# EAGLE design RJW VCA (EAGLE 7.5.0)
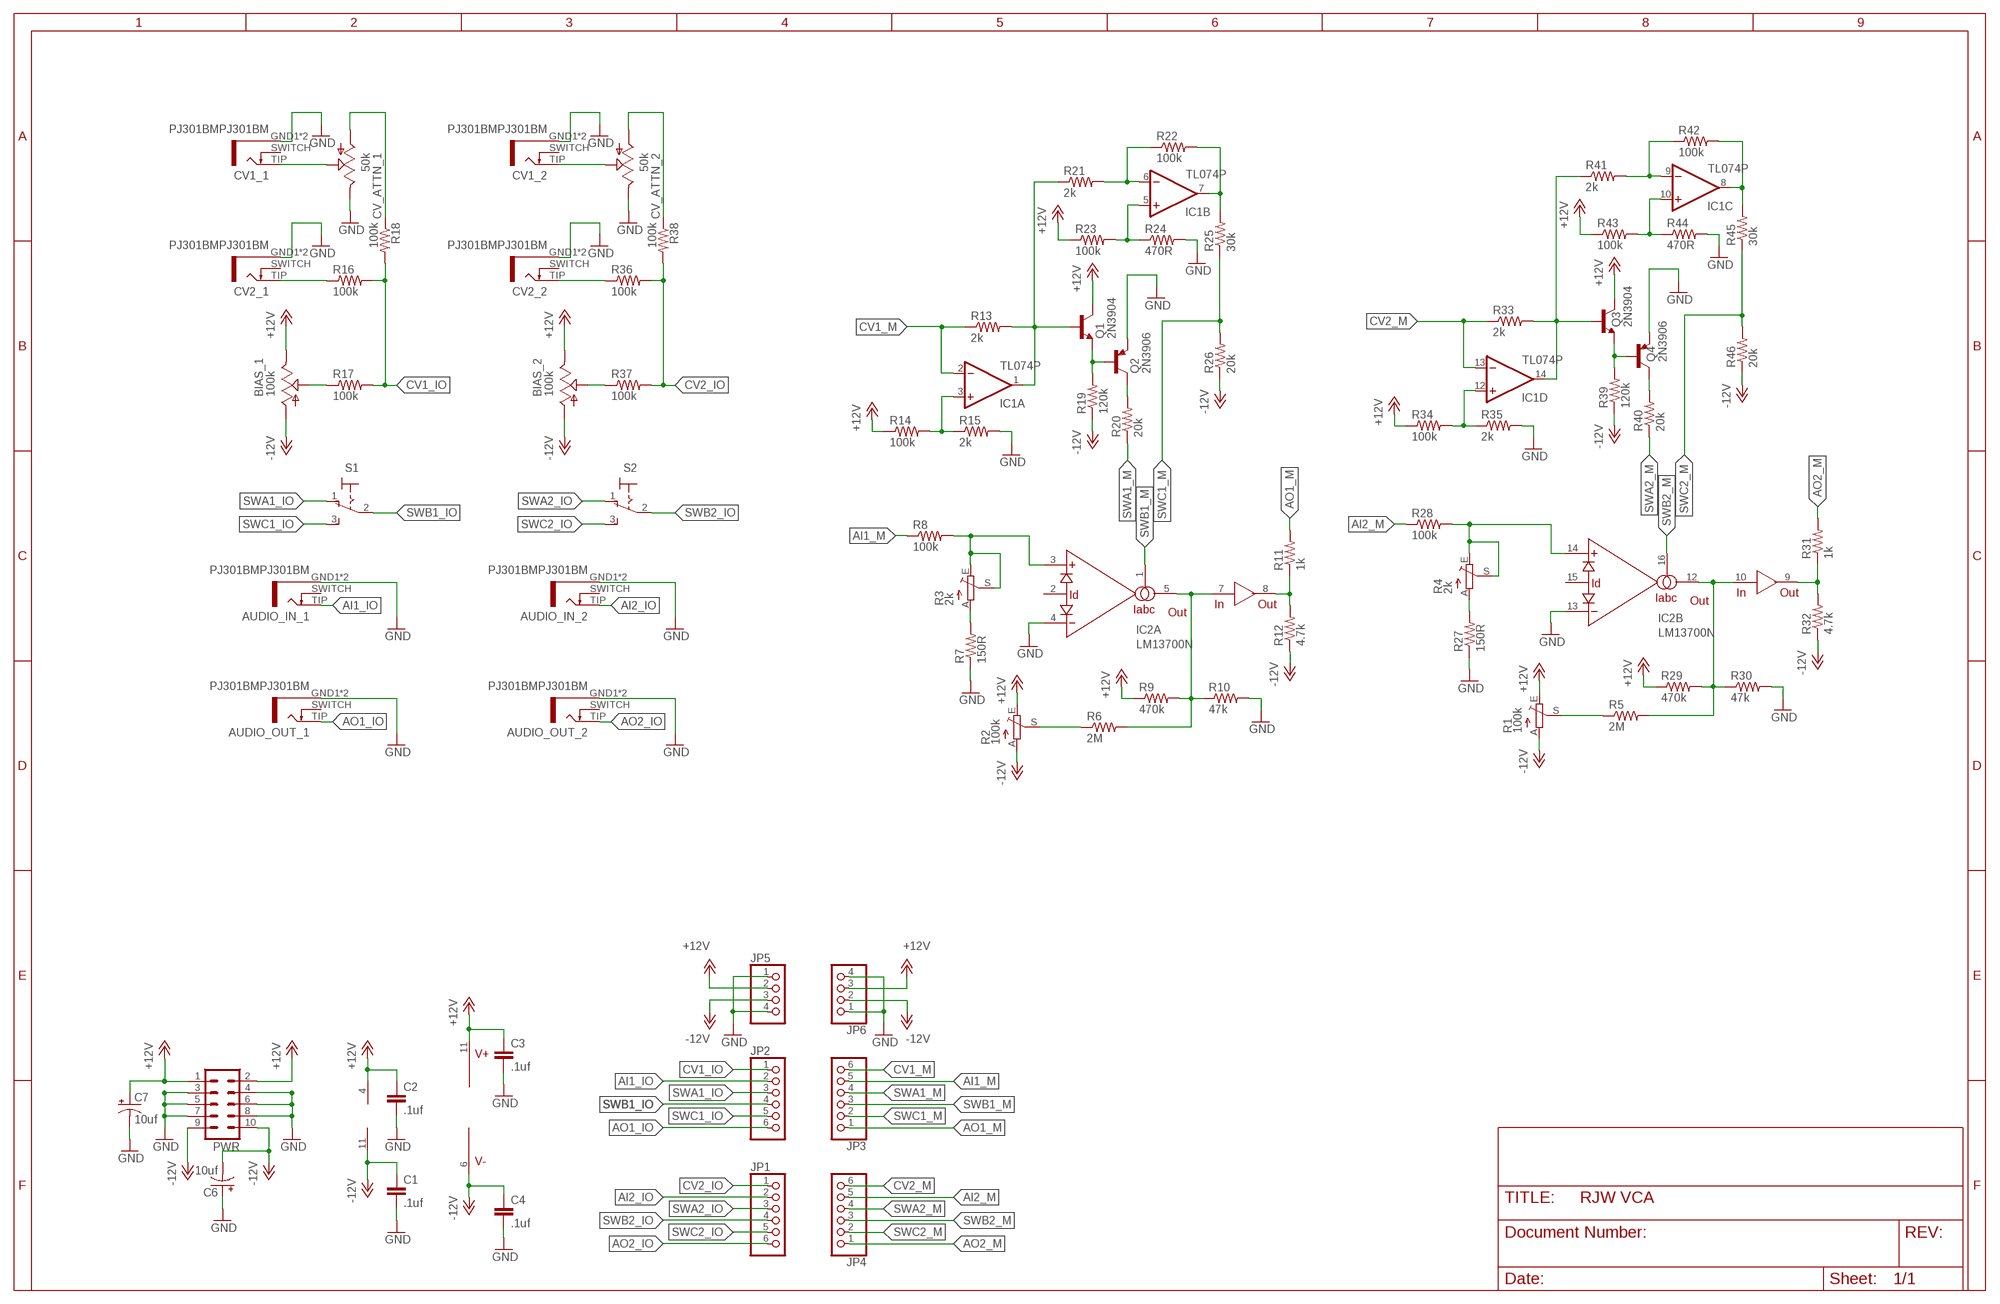
[diagram p0: schematic, sheet 1]

## Parts
AUDIO_IN_1  PJ301BMPJ301BM  [PJ301BM]
AUDIO_IN_2  PJ301BMPJ301BM  [PJ301BM]
AUDIO_OUT_1  PJ301BMPJ301BM  [PJ301BM]
AUDIO_OUT_2  PJ301BMPJ301BM  [PJ301BM]
BIAS_1  100k  ALPHA-9MMA  [EVUF]
BIAS_2  100k  ALPHA-9MMA  [EVUF]
C1  .1uf  C-EU050-024X044  [C050-024X044]
C2  .1uf  C-EU050-024X044  [C050-024X044]
C3  .1uf  C-EU050-024X044  [C050-024X044]
C4  .1uf  C-EU050-024X044  [C050-024X044]
C6  10uf  CPOL-USE2.5-5  [E2,5-5]
C7  10uf  CPOL-USE2.5-5  [E2,5-5]
CV1_1  PJ301BMPJ301BM  [PJ301BM]
CV1_2  PJ301BMPJ301BM  [PJ301BM]
CV2_1  PJ301BMPJ301BM  [PJ301BM]
CV2_2  PJ301BMPJ301BM  [PJ301BM]
CV_ATTN_1  50k  ALPHA-9MMA  [EVUF]
CV_ATTN_2  50k  ALPHA-9MMA  [EVUF]
IC1  TL074P  [DIL14]
IC2  LM13700N  [DIL16]
JP1  PINHD-1X6  [1X06]
JP2  PINHD-1X6  [1X06]
JP3  PINHD-1X6  [1X06]
JP4  PINHD-1X6  [1X06]
JP5  PINHD-1X4  [1X04]
JP6  PINHD-1X4  [1X04]
PWR  ML10  [ML10]
Q1  2N3904  [TO92]
Q2  2N3906  [TO92]
Q3  2N3904  [TO92]
Q4  2N3906  [TO92]
R1  100k  TRIM_1234-S64YW  [S64YW]
R2  100k  TRIM_1234-S64YW  [S64YW]
R3  2k  TRIM_1234-S64YW  [S64YW]
R4  2k  TRIM_1234-S64YW  [S64YW]
R5  2M  R-US_0204/7  [0204/7]
R6  2M  R-US_0204/7  [0204/7]
R7  150R  R-US_0204/7  [0204/7]
R8  100k  R-US_0204/7  [0204/7]
R9  470k  R-US_0204/7  [0204/7]
R10  47k  R-US_0204/7  [0204/7]
R11  1k  R-US_0204/7  [0204/7]
R12  4.7k  R-US_0204/7  [0204/7]
R13  2k  R-US_0204/7  [0204/7]
R14  100k  R-US_0204/7  [0204/7]
R15  2k  R-US_0204/7  [0204/7]
R16  100k  R-US_0204/7  [0204/7]
R17  100k  R-US_0204/7  [0204/7]
R18  100k  R-US_0204/7  [0204/7]
R19  120k  R-US_0204/7  [0204/7]
R20  20k  R-US_0204/7  [0204/7]
R21  2k  R-US_0204/7  [0204/7]
R22  100k  R-US_0204/7  [0204/7]
R23  100k  R-US_0204/7  [0204/7]
R24  470R  R-US_0204/7  [0204/7]
R25  30k  R-US_0204/7  [0204/7]
R26  20k  R-US_0204/7  [0204/7]
R27  150R  R-US_0204/7  [0204/7]
R28  100k  R-US_0204/7  [0204/7]
R29  470k  R-US_0204/7  [0204/7]
R30  47k  R-US_0204/7  [0204/7]
R31  1k  R-US_0204/7  [0204/7]
R32  4.7k  R-US_0204/7  [0204/7]
R33  2k  R-US_0204/7  [0204/7]
R34  100k  R-US_0204/7  [0204/7]
R35  2k  R-US_0204/7  [0204/7]
R36  100k  R-US_0204/7  [0204/7]
R37  100k  R-US_0204/7  [0204/7]
R38  100k  R-US_0204/7  [0204/7]
R39  120k  R-US_0204/7  [0204/7]
R40  20k  R-US_0204/7  [0204/7]
R41  2k  R-US_0204/7  [0204/7]
R42  100k  R-US_0204/7  [0204/7]
R43  100k  R-US_0204/7  [0204/7]
R44  470R  R-US_0204/7  [0204/7]
R45  30k  R-US_0204/7  [0204/7]
R46  20k  R-US_0204/7  [0204/7]
S1  M9040P  [M9040P]
S2  M9040P  [M9040P]

## Nets
+12V: BIAS_1.3(E) BIAS_2.3(E) C2.1 C3.1 C7.+ IC1.4(P:V+) IC2.11(V+) JP5.2 JP6.3 PWR.1 PWR.2 Q1.1(C) Q3.1(C) R1.E R2.E R9.1 R14.1 R23.1 R29.1 R34.1 R43.1
-12V: BIAS_1.1(A) BIAS_2.1(A) C1.1 C4.1 C6.- IC1.11(P:V-) IC2.6(V-) JP5.3 JP6.2 PWR.9 PWR.10 R1.A R2.A R12.1 R19.1 R26.1 R32.1 R39.1 R46.1
AI1_IO: AUDIO_IN_1.TIP JP2.2
AI1_M: JP3.5 R8.1
AI2_IO: AUDIO_IN_2.TIP JP1.2
AI2_M: JP4.5 R28.1
AO1_IO: AUDIO_OUT_1.TIP JP2.6
AO1_M: JP3.1 R11.2
AO2_IO: AUDIO_OUT_2.TIP JP1.6
AO2_M: JP4.1 R31.2
CV1_IO: JP2.1 R16.2 R17.2 R18.2
CV1_M: IC1.2(A:-IN) JP3.6 R13.1
CV2_IO: JP1.1 R36.2 R37.2 R38.2
CV2_M: IC1.13(D:-IN) JP4.6 R33.1
GND: AUDIO_IN_1.GND1 AUDIO_IN_1.GND2 AUDIO_IN_2.GND1 AUDIO_IN_2.GND2 AUDIO_OUT_1.GND1 AUDIO_OUT_1.GND2 AUDIO_OUT_2.GND1 AUDIO_OUT_2.GND2 C1.2 C2.2 C3.2 C4.2 C6.+ C7.- CV1_1.GND1 CV1_1.GND2 CV1_2.GND1 CV1_2.GND2 CV2_1.GND1 CV2_1.GND2 CV2_2.GND1 CV2_2.GND2 CV_ATTN_1.3(E) CV_ATTN_2.3(E) IC2.4(A:-IN) IC2.13(B:-IN) JP5.1 JP5.4 JP6.1 JP6.4 PWR.3 PWR.4 PWR.5 PWR.6 PWR.7 PWR.8 Q2.3(E) Q4.3(E) R7.1 R10.2 R15.2 R24.2 R27.1 R30.2 R35.2 R44.2
IO_CV1: CV_ATTN_1.1(A) R18.1
IO_CV2: CV_ATTN_2.1(A) R38.1
N$1: R2.S R6.1
N$2: R3.A R7.2
N$3: IC2.3(A:+IN) R3.E R3.S R8.2
N$4: IC2.5(A:OUT) IC2.7(IN) R6.2 R9.2 R10.1
N$5: R4.A R27.2
N$7: IC2.8(OUT) R11.1 R12.2
N$8: BIAS_1.2(S) R17.1
N$9: IC1.1(A:OUT) Q1.2(B) R13.2 R21.1
N$10: IC1.3(A:+IN) R14.2 R15.1
N$11: IC1.5(B:+IN) R23.2 R24.1
N$12: CV2_1.TIP R16.1
N$15: Q1.3(E) Q2.2(B) R19.2
N$16: R1.S R5.1
N$17: Q2.1(C) R20.2
N$19: IC1.6(B:-IN) R21.2 R22.1
N$20: IC1.7(B:OUT) R22.2 R25.2
N$23: IC2.14(B:+IN) R4.E R4.S R28.2
N$24: IC2.10(IN) IC2.12(B:OUT) R5.2 R29.2 R30.1
N$27: IC2.9(OUT) R31.1 R32.2
N$29: IC1.14(D:OUT) Q3.2(B) R33.2 R41.1
N$30: IC1.12(D:+IN) R34.2 R35.1
N$34: Q3.3(E) Q4.2(B) R39.2
N$35: Q4.1(C) R40.2
N$36: IC1.9(C:-IN) R41.2 R42.1
N$37: IC1.8(C:OUT) R42.2 R45.2
N$38: IC1.10(C:+IN) R43.2 R44.1
N$41: CV1_1.TIP CV_ATTN_1.2(S)
N$46: CV1_2.TIP CV_ATTN_2.2(S)
N$47: BIAS_2.2(S) R37.1
N$48: CV2_2.TIP R36.1
SWA1_IO: JP2.3 S1.1(O)
SWA1_M: JP3.4 R20.1
SWA2_IO: JP1.3 S2.1(O)
SWA2_M: JP4.4 R40.1
SWB1_IO: JP2.4 S1.2(P)
SWB1_M: IC2.1(A:IABC) JP3.3
SWB2_IO: JP1.4 S2.2(P)
SWB2_M: IC2.16(B:IABC) JP4.3
SWC1_IO: JP2.5 S1.3(S)
SWC1_M: JP3.2 R25.1 R26.2
SWC2_IO: JP1.5 S2.3(S)
SWC2_M: JP4.2 R45.1 R46.2
Unconnected: AUDIO_IN_1.SWITCH AUDIO_IN_2.SWITCH AUDIO_OUT_1.SWITCH AUDIO_OUT_2.SWITCH CV1_1.SWITCH CV1_2.SWITCH CV2_1.SWITCH CV2_2.SWITCH IC2.2(A:ID) IC2.15(B:ID) R1.S@1(S) R2.S@1(S) R3.S@1(S) R4.S@1(S)

## Library data of the parts
AUDIO_IN_1 AUDIO_IN_2 AUDIO_OUT_1 AUDIO_OUT_2 CV1_1 CV1_2 CV2_1 CV2_2 = gerbster:PJ301BM
BIAS_1 BIAS_2 CV_ATTN_1 CV_ATTN_2 = TomW:ALPHA-9MM: 9 mm Square Rotary Potentiometers Source: Panasonic
C1-C4 = resistor:C-EU: CAPACITOR, European symbol
C6 C7 = resistor:CPOL-US: POLARIZED CAPACITOR, American symbol
IC1 = linear:TL074: OP AMP
IC2 = synthdiy:LM13700: National Dual OTA with buffers.
JP1-JP4 = pinhead:PINHD-1X6: PIN HEADER
JP5 JP6 = pinhead:PINHD-1X4: PIN HEADER
PWR = con-ml:ML10: HARTING; OC_FARNELL: unknown; OC_NEWARK: unknown
Q1 Q3 = transistor-npn:2N3904: NPN Transistor
Q2 Q4 = transistor-pnp:2N3906: PNP Transistor
R1-R4 = pot:TRIM_1234-: POTENTIOMETER
R5-R46 = resistor:R-US_: RESISTOR, American symbol
S1 S2 = switch:M9040P: TOGGLE SWITCH Marquardt

## Board
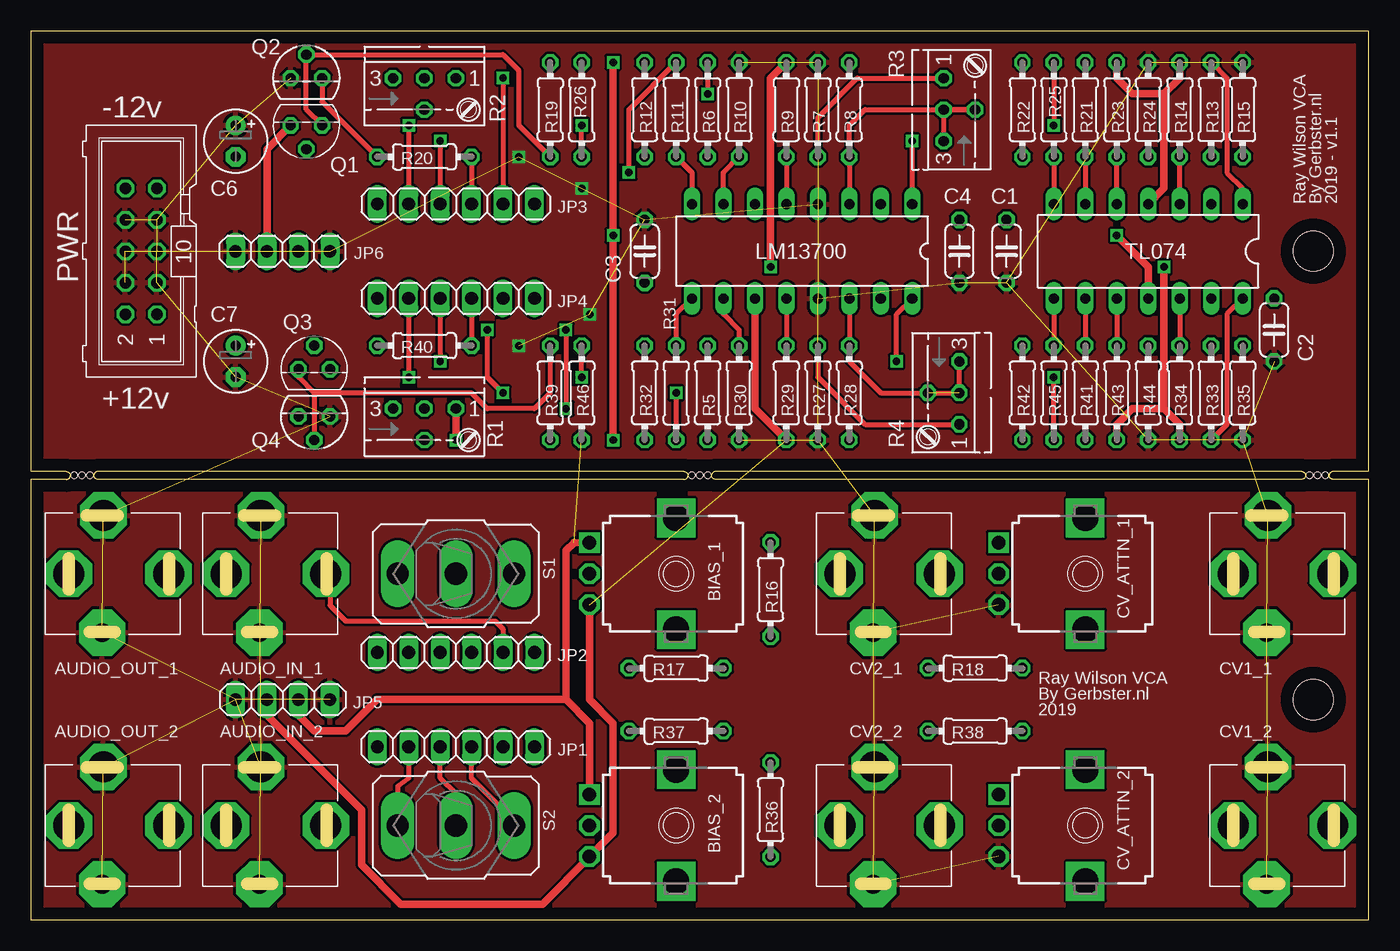
[diagram p1: board, top side]
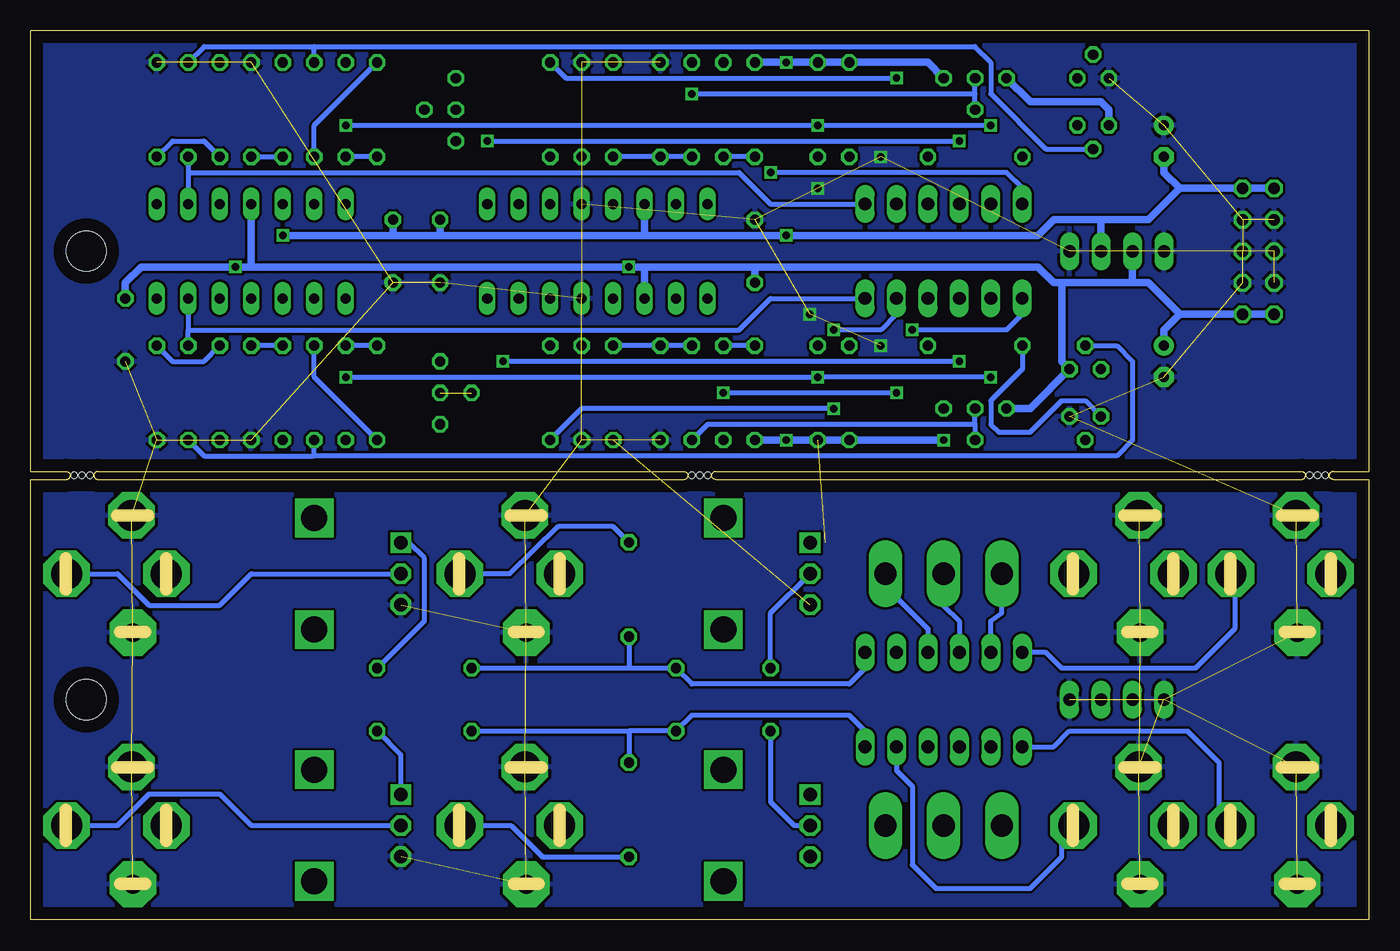
[diagram p2: board, bottom side, seen from below]

Size 107.95 x 71.75 mm. Coordinates in mm from the lower left corner, seen from the top.
Outline: 0,35.56 0,0 107.95,0 107.95,35.56 105.09,35.56 arc-90 104.78,35.88 arc-90 105.09,36.2 107.95,36.2 107.95,71.75 0,71.75 0,36.2 2.86,36.2 arc-90 3.17,35.88 arc-90 2.86,35.56 0,35.56
Outline: 102.55,35.56 55.24,35.56 arc-90 54.93,35.88 arc-90 55.24,36.2 102.55,36.2 arc-90 102.87,35.88 arc-90 102.55,35.56
Outline: 52.7,35.56 5.4,35.56 arc-90 5.08,35.88 arc-90 5.4,36.2 52.7,36.2 arc-90 53.02,35.88 arc-90 52.7,35.56
Copper layers (1*16): Top 0.035mm / dielectric 1.5mm / Bottom 0.035mm
Design rules "default": minimum track width 10mil, minimum drill 24mil, track to track 8mil, track to pad 8mil, pad to pad 8mil, via to via 8mil, smd to smd 8mil, copper to edge 40mil, drill to drill 8mil, minimum pad ring 10mil, minimum via ring 8mil, stop-mask expansion 4mil, vias tented up to drill 0mil, thermal gap 10mil
Holes 3.21 mm at 103.5,17.78 103.5,53.98
Holes 0.5 mm at 3.49,35.88 4.13,35.88 4.76,35.88 104.46,35.88 103.82,35.88 103.19,35.88 53.34,35.88 53.98,35.88 54.61,35.88

### Footprints (pad centres in the part's own frame; a part is rotated, then mirrored left to right if it is on the bottom)
PJ301BM = drill 2.5 pad 3.75 octagon: GND1 -4.719,-0.5; SWITCH 0,-3.3; TIP 0,4.746 | drill 1.5 pad 3.75 octagon: GND2 4.746,-0.6
EVUF = drill 1.1 pad 1.676 square: 1 -2.5,-7 | drill 1.1 pad 1.676 octagon: 2 0,-7; 3 2.5,-7 | drill 2.1 pad 2.8 square: M1 4.5,0; M2 -4.5,0
C050-024X044 = drill 0.813 octagon: 1 -2.54,0; 2 2.54,0
E2,5-5 = drill 0.813 pad 1.6: + -1.27,0 | drill 0.813 pad 1.6 octagon: - 1.27,0
DIL14 = drill 0.813 long: 1 -7.62,-3.81; 2 -5.08,-3.81; 3 -2.54,-3.81; 4 0,-3.81; 5 2.54,-3.81; 6 5.08,-3.81; 7 7.62,-3.81; 8 7.62,3.81; 9 5.08,3.81; 10 2.54,3.81; 11 0,3.81; 12 -2.54,3.81; 13 -5.08,3.81; 14 -7.62,3.81
DIL16 = drill 0.813 long: 1 -8.89,-3.81; 2 -6.35,-3.81; 3 -3.81,-3.81; 4 -1.27,-3.81; 5 1.27,-3.81; 6 3.81,-3.81; 7 6.35,-3.81; 8 8.89,-3.81; 9 8.89,3.81; 10 6.35,3.81; 11 3.81,3.81; 12 1.27,3.81; 13 -1.27,3.81; 14 -3.81,3.81; 15 -6.35,3.81; 16 -8.89,3.81
1X06 = drill 1.016 long: 1 -6.35,0; 2 -3.81,0; 3 -1.27,0; 4 1.27,0; 5 3.81,0; 6 6.35,0
1X04 = drill 1.016 long: 1 -3.81,0; 2 -1.27,0; 3 1.27,0; 4 3.81,0
ML10 = drill 0.914 octagon: 1 -5.08,-1.27; 2 -5.08,1.27; 3 -2.54,-1.27; 4 -2.54,1.27; 5 0,-1.27; 6 0,1.27; 7 2.54,-1.27; 8 2.54,1.27; 9 5.08,-1.27; 10 5.08,1.27
TO92 = drill 0.813 octagon: 1 1.27,0; 2 0,1.905; 3 -1.27,0
S64YW = drill 0.813 octagon: A 2.54,1.27; E -2.54,1.27; S 0,-1.27; S@1 0,1.27
0204/7 = drill 0.813 octagon: 1 -3.81,0; 2 3.81,0
M9040P = drill 1.803 long: 1 0,4.699; 2 0,0; 3 0,-4.699

### Placement (x,y rotation side)
AUDIO_IN_1  19.05,27.94 270 top
AUDIO_IN_2  19.05,7.62 270 top
AUDIO_OUT_1  6.35,27.94 270 top
AUDIO_OUT_2  6.35,7.62 270 top
BIAS_1  52.07,27.94 270 top
BIAS_2  52.07,7.62 270 top
C1  78.74,53.98 270 top
C2  100.33,47.62 270 top
C3  49.53,53.98 90 top
C4  74.93,53.98 270 top
C6  16.51,62.87 270 top
C7  16.51,45.09 270 top
CV1_1  100.33,27.94 270 top
CV1_2  100.33,7.62 270 top
CV2_1  68.58,27.94 270 top
CV2_2  68.58,7.62 270 top
CV_ATTN_1  85.09,27.94 270 top
CV_ATTN_2  85.09,7.62 270 top
IC1  90.17,53.98 180 top
IC2  62.23,53.98 180 top
JP1  34.29,13.97 180 top
JP2  34.29,21.59 180 top
JP3  34.29,57.78 0 top
JP4  34.29,50.16 0 top
JP5  20.32,17.78 0 top
JP6  20.32,53.98 180 top
PWR  8.89,53.98 90 top
Q1  22.23,64.14 180 top
Q2  22.23,67.94 0 top
Q3  22.86,44.45 0 top
Q4  22.86,40.64 180 top
R1  31.75,40.01 0 top
R2  31.75,66.67 0 top
R3  74.93,65.41 90 top
R4  73.66,42.55 270 top
R5  54.61,42.55 90 top
R6  54.61,65.41 270 top
R7  63.5,65.41 270 top
R8  66.04,65.41 270 top
R9  60.96,65.41 270 top
R10  57.15,65.41 90 top
R11  52.07,65.41 90 top
R12  49.53,65.41 270 top
R13  95.25,65.41 90 top
R14  92.71,65.41 270 top
R15  97.79,65.41 90 top
R16  59.69,26.67 270 top
R17  52.07,20.32 0 top
R18  76.2,20.32 180 top
R19  41.91,65.41 270 top
R20  31.75,61.59 180 top
R21  85.09,65.41 270 top
R22  80.01,65.41 270 top
R23  87.63,65.41 270 top
R24  90.17,65.41 90 top
R25  82.55,65.41 270 top
R26  44.45,65.41 270 top
R27  63.5,42.55 90 top
R28  66.04,42.55 90 top
R29  60.96,42.55 90 top
R30  57.15,42.55 270 top
R31  52.07,42.55 270 top
R32  49.53,42.55 90 top
R33  95.25,42.55 270 top
R34  92.71,42.55 90 top
R35  97.79,42.55 270 top
R36  59.69,8.89 90 top
R37  52.07,15.24 0 top
R38  76.2,15.24 180 top
R39  41.91,42.55 90 top
R40  31.75,46.35 180 top
R41  85.09,42.55 90 top
R42  80.01,42.55 90 top
R43  87.63,42.55 90 top
R44  90.17,42.55 270 top
R45  82.55,42.55 90 top
R46  44.45,42.55 90 top
S1  34.29,27.94 270 top
S2  34.29,7.62 270 top

### Tracks (layer width: path | path; a pad name or v marks a point on that pad's centre or on a via)
+12V  (via drill 0.6)  (1 unrouted)
  Top 0.61: JP6.3 19.05,62.23 Q1.1 | R43.1 87.63,40.01 88.9,41.27 91.44,41.27 | 91.44,41.27 92.71,40.01 R34.1 | 91.44,41.27 v91.44,52.7 | IC2.11 58.42,41.27 R29.1 | R14.1 92.71,67.94 91.44,66.67 | 91.44,66.67 91.44,59.05 IC1.4 | R23.1 87.63,67.94 88.9,66.67 91.44,66.67 | v59.69,52.7 59.69,67.94 R9.1 | BIAS_2.3 45.09,5.12 | BIAS_1.3 45.07,25.4 45.09,17.78 46.99,15.88 46.99,7.03 45.09,5.12 | JP5.2 19.05,16.51 26.67,8.89 26.67,4.45 29.84,1.27 41.27,1.27 45.09,5.08 45.09,5.12
  Bottom 0.61: C7.+ 16.51,47.62 15.24,48.9 | 8.89,48.9 PWR.1 | PWR.2 PWR.1 | PWR.1 15.24,48.9 | 19.05,51.44 17.78,51.44 15.24,48.9 | 19.05,51.44 24.77,51.44 | 24.77,51.44 24.77,45.09 Q3.1 27.3,41.27 R1.E | JP6.3 19.05,51.44 | 24.77,51.44 25.4,51.44 26.67,52.7 49.53,52.7 | C3.1 49.53,52.7 | 49.53,52.7 58.42,52.7 | 58.42,52.7 IC2.11 | C2.1 100.33,51.44 99.06,52.7 v91.44,52.7 90.17,52.7 | IC1.4 90.17,52.7 | 90.17,52.7 v59.69,52.7 58.42,52.7 | Q1.1 20.95,65.41 21.59,66.04 27.3,66.04 R2.E
-12V  (via drill 0.6)  (1 unrouted)
  Top 0.61: v87.63,55.24 90.17,52.7 IC1.11 | R1.A v34.29,38.73 | v46.99,38.73 v46.99,55.24 v46.99,69.22 | JP5.3 21.59,16.51 22.86,15.24 25.4,15.24 27.94,17.78 43.18,17.78 | 43.18,17.78 45.09,15.88 45.09,12.06 45.07,10.16 BIAS_2.1 | BIAS_1.1 43.81,30.48 43.81,30.44 43.18,29.8 43.18,17.78
  Bottom 0.406: R39.1 R46.1
  Bottom 0.61: PWR.10 PWR.9 15.24,59.05 | C6.- 16.51,60.33 15.24,59.05 | 15.24,59.05 17.78,56.52 21.59,56.52 | JP6.2 21.59,56.52 | 21.59,56.52 25.4,56.52 26.67,55.24 v46.99,55.24 58.42,55.24 | 58.42,55.24 IC2.6 | 58.42,55.24 74.93,55.24 | C4.1 74.93,55.24 | 74.93,55.24 78.74,55.24 | C1.1 78.74,55.24 | 78.74,55.24 v87.63,55.24 | R32.1 v46.99,38.73 R46.1 v34.29,38.73 | R12.1 v46.99,69.22 R26.1 R19.1 35.56,69.22 R2.A
AI1_IO
  Top 0.406: AUDIO_IN_1.TIP 24.13,27.94 24.13,25.4 25.4,24.13 37.47,24.13 38.1,23.5 JP2.2
AI1_M  (via drill 0.6)
  Top 0.406: v38.1,67.94 JP3.5
  Bottom 0.406: R8.1 64.77,67.94 v38.1,67.94
AI2_IO
  Bottom 0.406: JP1.2 38.1,12.06 36.83,10.79 36.83,4.45 34.92,2.54 27.3,2.54 24.77,5.08 24.77,7.62 AUDIO_IN_2.TIP
AI2_M  (via drill 0.6)
  Top 0.406: v43.18,47.62 v43.18,41.27
  Bottom 0.406: JP4.5 38.1,48.9 39.37,47.62 v43.18,47.62 | v43.18,41.27 63.5,41.27 R28.1
AO1_IO
  Bottom 0.406: AUDIO_OUT_1.TIP 10.79,27.94 10.79,23.5 13.97,20.32 24.77,20.32 26.04,21.59 JP2.6
AO1_M  (via drill 0.6)
  Top 0.406: v48.26,60.33 48.26,65.41 R11.2
  Bottom 0.406: JP3.1 27.94,59.05 29.21,60.33 v48.26,60.33
AO2_IO
  Bottom 0.406: JP1.6 25.4,13.97 24.13,15.24 14.61,15.24 12.06,12.7 12.06,8.89 AUDIO_OUT_2.TIP
AO2_M  (via drill 0.6)
  Top 0.406: v36.83,47.62 36.83,43.81 v38.1,42.55 | v52.07,42.55 R31.2
  Bottom 0.406: JP4.1 27.94,48.9 29.21,47.62 v36.83,47.62 | v38.1,42.55 v52.07,42.55
CV1_IO
  Bottom 0.406: JP2.1 40.64,20.32 41.91,19.05 54.61,19.05 R17.2 59.69,20.32 | R16.2 59.69,20.32 | 59.69,20.32 R18.2
CV1_M
  Bottom 0.406: R13.1 95.25,60.33 | 95.25,60.33 IC1.2 | 95.25,60.33 50.8,60.33 48.26,57.78 JP3.6
CV2_IO
  Bottom 0.406: JP1.1 40.64,15.24 41.91,16.51 54.61,16.51 R37.2 59.69,15.24 | 59.69,15.24 R36.2 | R38.2 59.69,15.24
CV2_M
  Bottom 0.406: IC1.13 95.25,47.62 | 95.25,47.62 50.8,47.62 48.26,50.16 JP4.6 | R33.1 95.25,47.62
GND  (via drill 0.6)  (49 unrouted)
  other vias: 45.09,48.9 44.45,59.05 39.37,61.59 39.37,46.35
  pour Top: 0,35.56 0,0 107.31,0 107.31,35.56
  pour Bottom: 0,35.56 0,0 107.31,0 107.31,35.56
  pour Bottom: 0,71.75 0,36.2 107.31,36.2 107.31,71.75
  pour Top: 0,71.75 0,36.2 107.31,36.2 107.31,71.75
IO_CV1
  Bottom 0.406: R18.1 76.2,24.13 76.2,29.21 77.47,30.48 78.09,30.48 CV_ATTN_1.1
IO_CV2
  Bottom 0.406: R38.1 78.11,13.34 78.11,10.16 78.09,10.16 CV_ATTN_2.1
N$1  (via drill 0.6)
  Top 0.406: R6.1 v54.61,66.67
  Bottom 0.406: v54.61,66.67 31.75,66.67 | 31.75,66.67 31.75,67.94 | R2.S 31.75,66.67
N$2
  Top 0.406: R7.2 63.5,64.77 66.67,67.94 R3.A
N$3
  Top 0.406: IC2.3 R8.2 66.04,64.14 67.31,65.41 R3.S 73.66,65.41 R3.E
N$4
  Top 0.406: IC2.7 55.88,60.33 R10.1 | R9.2 IC2.5
  Bottom 0.406: R6.2 R10.1 R9.2
N$5
  Top 0.406: R27.2 63.5,43.81 67.31,40.01 R4.A
N$7
  Top 0.406: R11.1 53.34,60.33 IC2.8
  Bottom 0.406: R12.2 R11.1
N$8
  Bottom 0.406: R17.1 48.26,24.77 BIAS_1.2
N$9
  Top 0.406: R13.2 96.52,67.94 96.52,60.33 97.79,59.05 IC1.1
  Bottom 0.406: R13.2 93.98,70.48 85.09,70.48 | R21.1 85.09,70.48 | 85.09,70.48 31.75,70.48 30.48,69.22 30.48,66.67 26.04,62.23 Q1.2
N$10
  Top 0.406: IC1.3 R14.2
  Bottom 0.406: R15.1 96.52,62.87 93.98,62.87 R14.2
N$11
  Top 0.406: IC1.5 R23.2
  Bottom 0.406: R24.1 R23.2
N$12
  Bottom 0.406: R16.1 60.96,31.75 65.41,31.75 69.32,27.94 CV2_1.TIP
N$15
  Top 0.406: Q1.3 22.23,65.41 Q2.2 38.1,69.85 39.37,68.58 39.37,64.14 R19.2
N$16
  Bottom 0.406: 31.75,40.01 53.34,40.01 R5.1 | 31.75,40.01 31.75,41.27 | 31.75,40.01 R1.S
N$17
  Top 0.406: Q2.1 23.5,66.04 R20.2
N$19
  Top 0.406: R21.2 IC1.6
  Bottom 0.406: R21.2 85.09,64.14 R22.1
N$20
  Top 0.406: R25.2 IC1.7
  Bottom 0.406: R22.2 R25.2
N$23  (1 unrouted)
  Top 0.406: IC2.14 R28.2 66.04,45.09 68.58,42.55 74.93,42.55 R4.E
N$24
  Top 0.406: IC2.10 55.88,48.9 57.15,47.62 R30.1 | IC2.12 R29.2
  Bottom 0.406: R5.2 R30.1 R29.2
N$27
  Top 0.406: IC2.9 52.07,48.9 R31.1
  Bottom 0.406: R32.2 R31.1
N$29
  Top 0.406: IC1.14 96.52,48.9 96.52,40.01 R33.2
  Bottom 0.406: R33.2 93.98,37.47 85.09,37.47 | Q3.2 20.32,46.35 19.05,45.09 19.05,38.73 20.32,37.47 85.09,37.47 | 85.09,37.47 R41.1
N$30
  Top 0.406: IC1.12 R34.2
  Bottom 0.406: R35.1 96.52,45.09 93.98,45.09 R34.2
N$34
  Top 0.406: Q3.3 21.59,43.81 22.86,42.55 | 22.86,42.55 Q4.2 | R39.2 41.91,42.55 40.64,41.27 36.83,41.27 35.56,42.55 22.86,42.55
N$35
  Bottom 0.406: R40.2 27.94,44.45 30.48,41.91 30.48,40.01 29.84,39.37 27.3,39.37 24.77,41.91 22.86,41.91 Q4.1
N$36
  Top 0.406: IC1.9 R41.2
  Bottom 0.406: R42.1 85.09,43.81 R41.2
N$37
  Top 0.406: IC1.8 R45.2
  Bottom 0.406: R42.2 R45.2
N$38
  Top 0.406: IC1.10 R43.2
  Bottom 0.406: R43.2 R44.1
N$41
  Bottom 0.406: CV1_1.TIP 100.97,27.94 98.42,25.4 92.71,25.4 90.17,27.94 CV_ATTN_1.2
N$46
  Bottom 0.406: CV1_2.TIP 100.97,7.62 98.42,10.16 92.71,10.16 90.17,7.62 CV_ATTN_2.2
N$47
  Bottom 0.406: R37.1 48.26,9.53 46.35,7.62 BIAS_2.2
N$48
  Bottom 0.406: CV2_2.TIP 69.22,7.62 66.67,5.08 R36.1
SWA1_IO
  Bottom 0.406: S1.1 38.73,27.94 38.73,26.67 35.56,23.5 JP2.3
SWA1_M
  Top 0.406: R20.1 JP3.4
SWA2_IO
  Top 0.406: S2.1 38.73,7.62 38.73,8.26 35.56,11.43 JP1.3
SWA2_M
  Top 0.406: JP4.4 R40.1
SWB1_IO
  Bottom 0.406: S1.2 34.29,25.4 33.02,24.13 JP2.4
SWB1_M  (via drill 0.6)
  Top 0.406: IC2.1 v71.12,62.87 | v33.02,62.87 JP3.3
  Bottom 0.406: v71.12,62.87 v33.02,62.87
SWB2_IO
  Top 0.406: S2.2 34.29,10.16 33.02,11.43 JP1.4
SWB2_M  (via drill 0.6)
  Top 0.406: JP4.3 v33.02,45.09 | v69.85,45.09 69.85,48.9 IC2.16
  Bottom 0.406: v33.02,45.09 v69.85,45.09
SWC1_IO
  Bottom 0.406: JP2.5 30.48,24.13 29.59,24.77 S1.3
SWC1_M  (via drill 0.6)
  Top 0.406: R25.1 v82.55,64.14 | R26.2 v44.45,64.14 | v30.48,64.14 JP3.2
  Bottom 0.406: v82.55,64.14 v44.45,64.14 v30.48,64.14
SWC2_IO
  Top 0.406: JP1.5 30.48,11.43 29.59,10.79 S2.3
SWC2_M  (via drill 0.6)
  Top 0.406: R45.1 v82.55,43.81 | v44.45,43.81 R46.2 | JP4.2 v30.48,43.81
  Bottom 0.406: v82.55,43.81 v44.45,43.81 v30.48,43.81

### Text on the board
tNames: -12v | Ray Wilson VCA | By Gerbster.nl | 2019 - v1.1 | LM13700 | TL074 | +12v | Ray Wilson VCA | By Gerbster.nl | 2019